# Altium schematic sheet Quad Comparator.SchDoc
size A
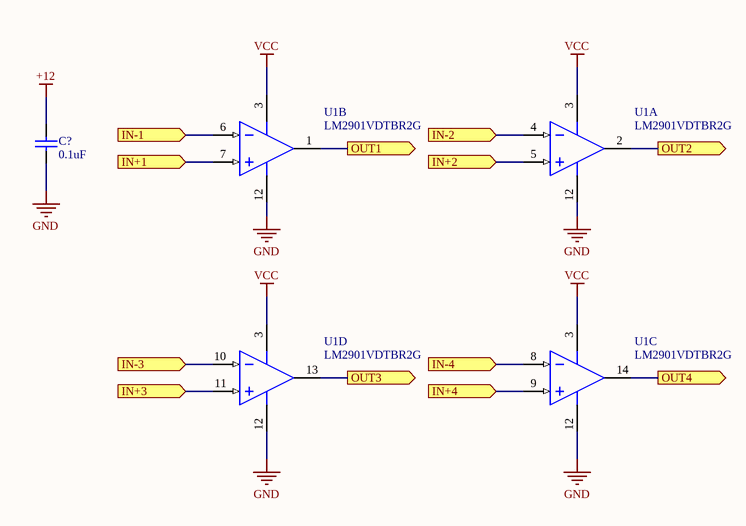
[diagram p0: Quad Comparator.SchDoc]

## Parts
C?  value 0.1uF  [1608[0603]]  (hidden comment: Cap)
U1  LM2901VDTBR2G  [ONSC-TSSOP-14-948G-01_V]  (parts A,B,C,D of 4)

## Ports
IN+1 (in), IN+2 (in), IN+3 (in), IN+4 (in), IN-1 (in), IN-2 (in), IN-3 (in), IN-4 (in), OUT1 (out), OUT2 (out), OUT3 (out), OUT4 (out)

## Nets
+12: C?.2
GND: C?.1 U1.12(GND)
VCC: U1.3(VCC)
IN+1: U1.7(IN2+) ; port IN+1
IN+2: U1.5(IN1+) ; port IN+2
IN+3: U1.11(IN4+) ; port IN+3
IN+4: U1.9(IN3+) ; port IN+4
IN-1: U1.6(IN2-) ; port IN-1
IN-2: U1.4(IN1-) ; port IN-2
IN-3: U1.10(IN4-) ; port IN-3
IN-4: U1.8(IN3-) ; port IN-4
OUT1: U1.1(OUT2) ; port OUT1
OUT2: U1.2(OUT1) ; port OUT2
OUT3: U1.13(OUT4) ; port OUT3
OUT4: U1.14(OUT3) ; port OUT4

## Library data of the parts
C? = Cap: Capacitor; Published: 8-Jun-2000; LatestRevisionDate: 17-Jul-2002; LatestRevisionNote: Re-released for DXP Platform.; PackageReference: RAD-0.3; Publisher: Altium Limited; PackageDescription: Radial Cap, Thru-Hole; 2 Leads; 0.3 in Pin Spacing
U1 = CMP-1305-00071-1: Single Supply Quad Comparators, -40 to 125 degC, 14-Pin TSSOP, Pb-Free, Tape and Reel; Manufacturer: On Semiconductor; IO Typ (mA): 16; ComponentLink1Description: Manufacturer URL; ComponentLink1URL: http://www.onsemi.com/; PackageReference: TSSOP-14-948G-01; Mounting Technology: Surface Mount; ComponentLink2URL: http://www.onsemi.com/pub_link/Collateral/LM339-D.PDF; RoHS: TRUE; ComponentLink3URL: http://www.onsemi.com/pub_link/Collateral/948G-01.PDF; Packing: Tape and Reel; PackageDescription: 14-Pin Small Outline Package, Body 5 x 4.4 mm, Pitch 0.65 mm; ComponentLink3Description: Package Specification; PartNumber: LM2901VDTBR2G; DatasheetVersion: Rev. 20; ComponentLink2Description: Datasheet; PackageVersion: Rev. B, 10/2006; PartId: 1